# Altium schematic sheet 04-Switch_RJ45.SchDoc
size C; SheetNumber: 4; SheetTotal: 13
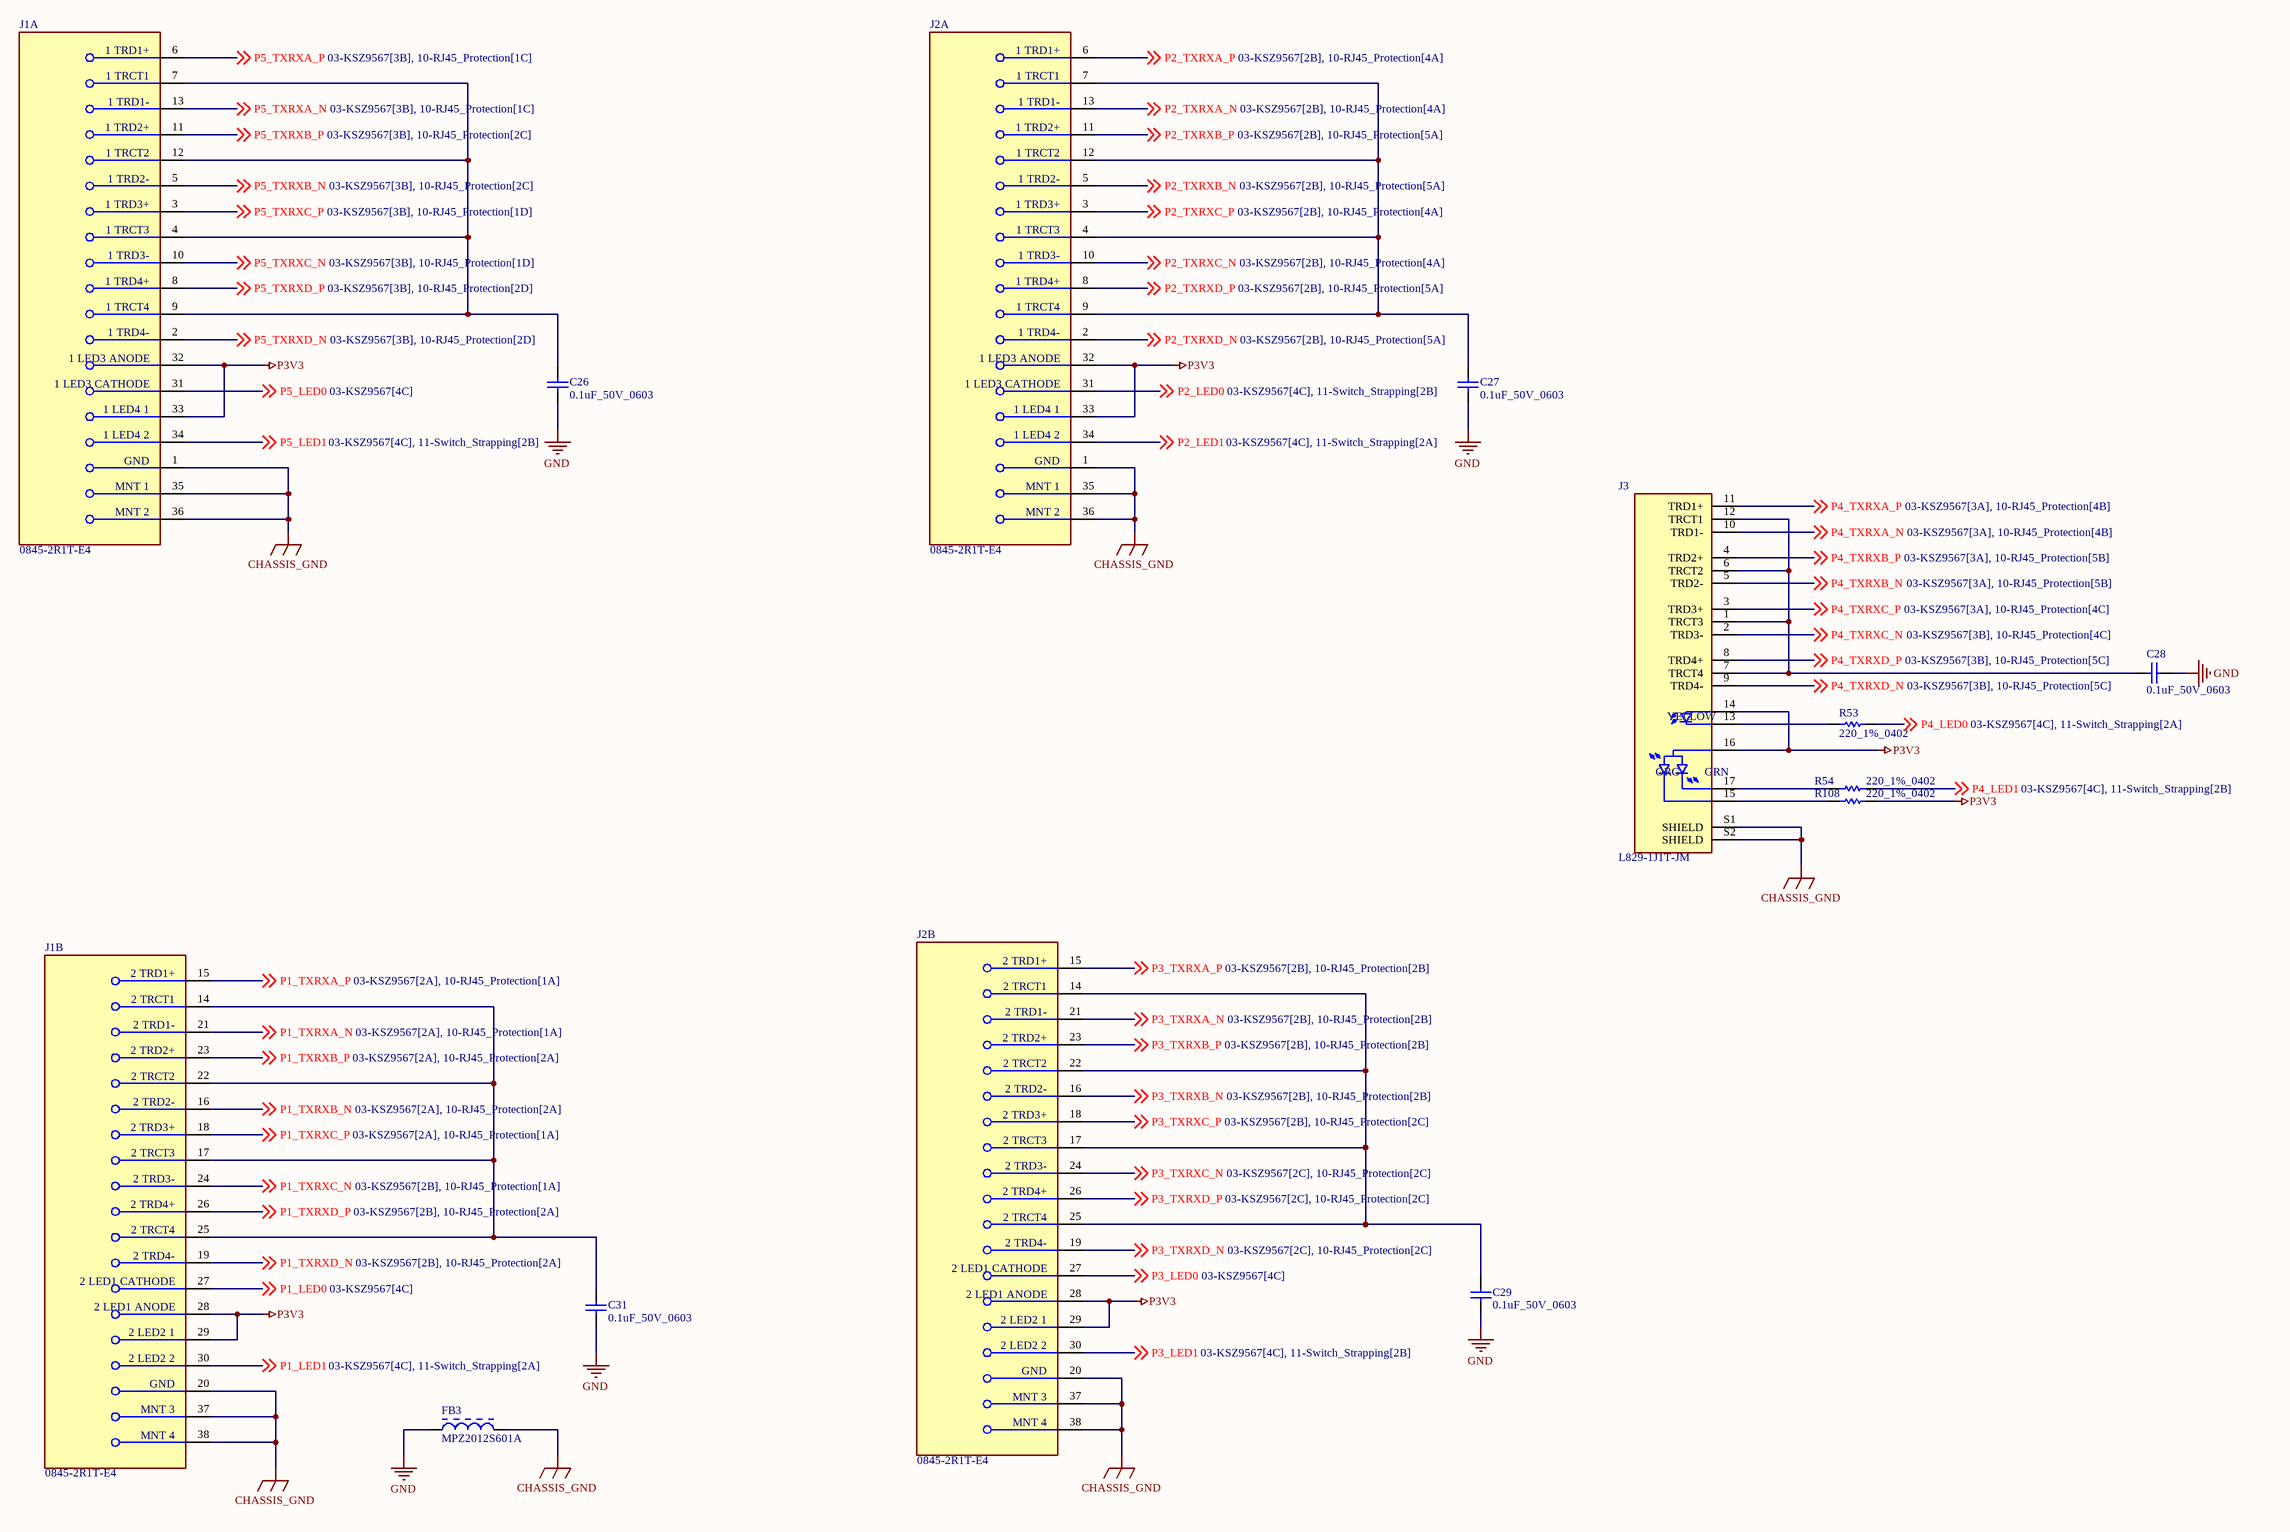
[diagram p0: 04-Switch_RJ45.SchDoc]

## Parts
C26  0.1uF_50V_0603  [CAPC1608X90X35ML10T15]
C27  0.1uF_50V_0603  [CAPC1608X90X35ML10T15]
C28  0.1uF_50V_0603  [CAPC1608X90X35ML10T15]
C29  0.1uF_50V_0603  [CAPC1608X90X35ML10T15]
C31  0.1uF_50V_0603  [CAPC1608X90X35ML10T15]
FB3  MPZ2012S601A  [TDK-MPZ2012_V]
J1  0845-2R1T-E4  [FP-0845-2R1T-E4-MFG]  (parts A,B of 2)
J2  0845-2R1T-E4  [FP-0845-2R1T-E4-MFG]  (parts A,B of 2)
J3  L829-1J1T-JM  [BEL_L829-1J1T-JM]
R53  220_1%_0402  [RESC1005X40X25LL10T10]
R54  220_1%_0402  [RESC1005X40X25LL10T10]
R108  220_1%_0402  [RESC1005X40X25LL10T10]

## Nets
CHASSIS_GND: FB3.2 J1.1(GND) J1.20(GND) J1.35(MNT_1) J1.36(MNT_2) J1.37(MNT_3) J1.38(MNT_4) J2.1(GND) J2.20(GND) J2.35(MNT_1) J2.36(MNT_2) J2.37(MNT_3) J2.38(MNT_4) J3.S1(SHIELD) J3.S2(SHIELD)
GND: C26.1 C27.1 C28.1 C29.1 C31.1 FB3.1
P3V3: J1.28(2_LED1_ANODE) J1.29(2_LED2_1) J1.32(1_LED3_ANODE) J1.33(1_LED4_1) J2.28(2_LED1_ANODE) J2.29(2_LED2_1) J2.32(1_LED3_ANODE) J2.33(1_LED4_1) J3.14(YA_1) J3.16(CA) R108.2
P1_LED0: J1.27(2_LED1_CATHODE) ; off-sheet P1_LED0
P1_LED1: J1.30(2_LED2_2) ; off-sheet P1_LED1
P1_TXRXA_N: J1.21(2_TRD1-) ; off-sheet P1_TXRXA_N
P1_TXRXA_P: J1.15(2_TRD1+) ; off-sheet P1_TXRXA_P
P1_TXRXB_N: J1.16(2_TRD2-) ; off-sheet P1_TXRXB_N
P1_TXRXB_P: J1.23(2_TRD2+) ; off-sheet P1_TXRXB_P
P1_TXRXC_N: J1.24(2_TRD3-) ; off-sheet P1_TXRXC_N
P1_TXRXC_P: J1.18(2_TRD3+) ; off-sheet P1_TXRXC_P
P1_TXRXD_N: J1.19(2_TRD4-) ; off-sheet P1_TXRXD_N
P1_TXRXD_P: J1.26(2_TRD4+) ; off-sheet P1_TXRXD_P
P2_LED0: J2.31(1_LED3_CATHODE) ; off-sheet P2_LED0
P2_LED1: J2.34(1_LED4_2) ; off-sheet P2_LED1
P2_TXRXA_N: J2.13(1_TRD1-) ; off-sheet P2_TXRXA_N
P2_TXRXA_P: J2.6(1_TRD1+) ; off-sheet P2_TXRXA_P
P2_TXRXB_N: J2.5(1_TRD2-) ; off-sheet P2_TXRXB_N
P2_TXRXB_P: J2.11(1_TRD2+) ; off-sheet P2_TXRXB_P
P2_TXRXC_N: J2.10(1_TRD3-) ; off-sheet P2_TXRXC_N
P2_TXRXC_P: J2.3(1_TRD3+) ; off-sheet P2_TXRXC_P
P2_TXRXD_N: J2.2(1_TRD4-) ; off-sheet P2_TXRXD_N
P2_TXRXD_P: J2.8(1_TRD4+) ; off-sheet P2_TXRXD_P
P3_LED0: J2.27(2_LED1_CATHODE) ; off-sheet P3_LED0
P3_LED1: J2.30(2_LED2_2) ; off-sheet P3_LED1
P3_TXRXA_N: J2.21(2_TRD1-) ; off-sheet P3_TXRXA_N
P3_TXRXA_P: J2.15(2_TRD1+) ; off-sheet P3_TXRXA_P
P3_TXRXB_N: J2.16(2_TRD2-) ; off-sheet P3_TXRXB_N
P3_TXRXB_P: J2.23(2_TRD2+) ; off-sheet P3_TXRXB_P
P3_TXRXC_N: J2.24(2_TRD3-) ; off-sheet P3_TXRXC_N
P3_TXRXC_P: J2.18(2_TRD3+) ; off-sheet P3_TXRXC_P
P3_TXRXD_N: J2.19(2_TRD4-) ; off-sheet P3_TXRXD_N
P3_TXRXD_P: J2.26(2_TRD4+) ; off-sheet P3_TXRXD_P
P4_LED0: R53.2 ; off-sheet P4_LED0
P4_LED1: R54.2 ; off-sheet P4_LED1
P4_TXRXA_N: J3.10(TRD1-) ; off-sheet P4_TXRXA_N
P4_TXRXA_P: J3.11(TRD1+) ; off-sheet P4_TXRXA_P
P4_TXRXB_N: J3.5(TRD2-) ; off-sheet P4_TXRXB_N
P4_TXRXB_P: J3.4(TRD2+) ; off-sheet P4_TXRXB_P
P4_TXRXC_N: J3.2(TRD3-) ; off-sheet P4_TXRXC_N
P4_TXRXC_P: J3.3(TRD3+) ; off-sheet P4_TXRXC_P
P4_TXRXD_N: J3.9(TRD4-) ; off-sheet P4_TXRXD_N
P4_TXRXD_P: J3.8(TRD4+) ; off-sheet P4_TXRXD_P
P5_LED0: J1.31(1_LED3_CATHODE) ; off-sheet P5_LED0
P5_LED1: J1.34(1_LED4_2) ; off-sheet P5_LED1
P5_TXRXA_N: J1.13(1_TRD1-) ; off-sheet P5_TXRXA_N
P5_TXRXA_P: J1.6(1_TRD1+) ; off-sheet P5_TXRXA_P
P5_TXRXB_N: J1.5(1_TRD2-) ; off-sheet P5_TXRXB_N
P5_TXRXB_P: J1.11(1_TRD2+) ; off-sheet P5_TXRXB_P
P5_TXRXC_N: J1.10(1_TRD3-) ; off-sheet P5_TXRXC_N
P5_TXRXC_P: J1.3(1_TRD3+) ; off-sheet P5_TXRXC_P
P5_TXRXD_N: J1.2(1_TRD4-) ; off-sheet P5_TXRXD_N
P5_TXRXD_P: J1.8(1_TRD4+) ; off-sheet P5_TXRXD_P
NetC26_2: C26.2 J1.4(1_TRCT3) J1.7(1_TRCT1) J1.9(1_TRCT4) J1.12(1_TRCT2)
NetC27_2: C27.2 J2.4(1_TRCT3) J2.7(1_TRCT1) J2.9(1_TRCT4) J2.12(1_TRCT2)
NetC28_2: C28.2 J3.1(TRCT3) J3.6(TRCT2) J3.7(TRCT4) J3.12(TRCT1)
NetC29_2: C29.2 J2.14(2_TRCT1) J2.17(2_TRCT3) J2.22(2_TRCT2) J2.25(2_TRCT4)
NetC31_2: C31.2 J1.14(2_TRCT1) J1.17(2_TRCT3) J1.22(2_TRCT2) J1.25(2_TRCT4)
NetJ3_13: J3.13(YK_1) R53.1
NetJ3_15: J3.15(OK_1) R108.1
NetJ3_17: J3.17(GK_1) R54.1

## Notes on the sheet
- (in symbol L829-1J1T-JM) YELLOW; ORG; GRN

## Library data of the parts
C26-C29 C31 = CMP-2100-03643-1: Chip Capacitor, 0.1 uF, +/- 10%, 50 V, -55 to 125 degC, 0603 (1608 Metric), RoHS, Tape and Reel; Manufacturer: Murata; Dielectric Material: Ceramic; Voltage Rating: 50V; Capacitance: 100nF; Dielectric: X7R; Insulation Resistance: 10GR; Case Code (Metric): 1608; Lead Free: LeadFree; Depth: 0.8mm; Number of Pins: 2; Radiation Hardening: No; Case/Package: 0603; Manufacturer URL: http://www.murata.com/; Packaging: TapeandReel; Length: 1.6mm; Contact Plating: Tin; Datasheet URL: http://psearch.en.murata.com/capacitor/product/GRM188R71H104KA93%23.pdf; Tolerance: 10%; Case Code (Imperial): 0603; Min Operating Temperature: -55degC; RoHSCompliant: true; Voltage: 50V; Termination: SMD/SMT; Mount: SurfaceMount; Material: Ceramic; Package Quantity: 1; Height: 0.8mm; Thickness: 0.035inch; REACH SVHC: NoSVHC; Max Operating Temperature: 125degC; Width: 0.8mm; Package Reference: 0603; Voltage Rating (DC): 50V; Datasheet Version: 42675.0; Package Description: 2-Pin Surface Mount Device, Body 1.6 x 0.8 mm
FB3 = CMP-2000-05400-1: Chip Bead for Power Line, 600 Ohm, +/- 25%, 2 A, -55 to 125 degC, 2-Pin SMD (0805), RoHS, Tape and Reel; Manufacturer: TDK; Maximum DC Current: 2A; Impedance: 600Ohms; Test Frequency: 100MHz; Case Length: 2mm; Maximum DC Resistance: 100mOhms; Case Height: 0.85mm; Case Width: 1.25mm; Factory Pack Quantity: 4000; Operating Temperature Range: -55Cto+125C; Packaging: Reel; Datasheet URL: https://datasheet.ciiva.com/23763/1750041-23763249.pdf; Manufacturer URL: http://www.tdk.com/; Product Category: EMIFilterBeads,Chips&Arrays; Tolerance: 25%; Product: FerriteChipBeads; Package / Case: 0805(2012metric); RoHS: Details; Dimensions: 1.25mmWx2mmLx0.85mmH; Datasheet Version: Jul-13; Termination Style: SMD/SMT; Package Reference: 805; Brand: TDK; Package Description: 2-Pin Surface Mount Device, Body 2 x 1.25 mm
J1 J2 = CMP-16034-000001-1: CONN MAGJACK 2PORT 1000 BASE-T; Manufacturer: Bel Fuse; Is Female: yes; Number Of Contacts: 26; Pitch: 2.01mm; Conn Gender: Female; Shielding: false; Conn Orientation: Horizontal; Digikey Description: CONN MAGJACK 2PORT 1000 BASE-T; Temperature Range High: +70°C; Device Class L2: Modular / Ethernet Connectors; Mouser Description: Conn RJ-45 F 16 POS 2.01mm Solder RA Thru-Hole 34 Terminal 2 Port Tray; Automotive: No; Height: 1.155inch; Category: Conn; Contact Material: Gold,Nickel; ComponentLink2URL: https://www.belfuse.com/resources/drawings/magneticsolutions/dr-mag-0845-2r1t-e4.pdf; Lead Free: Yes; Temperature: 0°C to +70°C; Octopart: https://octopart.com/0845-2r1t-e4-bel+fuse-10528446; Device Class L1: Connectors; Device Class L3: unset; RoHS: TRUE; ComponentLink2Description: Datasheet; Manufacturer Part Number: 0845-2R1T-E4; Temperature Range Low: 0°C; Package: 0
J3 = L829-1J1T-JM: MagJack 2.5GBASE-T | 1X1 | OG/Y LED | -40 to 85C | RoHS; MF: Bel Magnetic Solutions; MP: L829-1J1T-JM; DigiKey-Purchase-URL: https://snapeda.com/shop?store=DigiKey&id=2758678; SnapEDA_Link: https://www.snapeda.com/parts/L829-1J1T-JM/Bel%20Magnetic%20Solutions/view-part/2758678/?ref=snap; Digi-Key_Part_Number: 507-2068-ND; Package: None; Value: *
R53 R54 R108 = CMP-2002-03891-1: Part Number: RK73H1ETTP2200F; Manufacturer: KOA Speer